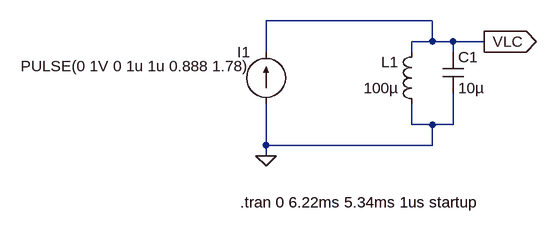
[diagram p0: schematic LC4.asc]
LC4.asc, the LTspice schematic file:
Version 4
SHEET 1 880 680
WIRE 400 208 144 208
WIRE 400 240 400 208
WIRE 400 240 368 240
WIRE 432 240 400 240
WIRE 480 240 432 240
WIRE 144 256 144 208
WIRE 368 256 368 240
WIRE 432 256 432 240
WIRE 368 368 368 336
WIRE 400 368 368 368
WIRE 432 368 432 320
WIRE 432 368 400 368
WIRE 144 400 144 336
WIRE 400 400 400 368
WIRE 400 400 144 400
WIRE 144 416 144 400
FLAG 144 416 0
FLAG 480 240 VLC
IOPIN 480 240 Out
SYMBOL current 144 336 R180
WINDOW 0 24 80 Left 2
WINDOW 3 24 58 Left 2
SYMATTR InstName I1
SYMATTR Value PULSE(0 1V 0 1u 1u 0.888 1.78)
SYMBOL ind 384 352 R180
WINDOW 0 36 80 Left 2
WINDOW 3 36 40 Left 2
SYMATTR InstName L1
SYMATTR Value 100µ
SYMATTR SpiceLine Ipk=1 Rser=85m Rpar=infin. Cpar=0 mfg="Coiltronics" pn="CTX100-1-52"
SYMBOL cap 416 256 R0
SYMATTR InstName C1
SYMATTR Value 10µ
TEXT 104 488 Left 2 !.tran 0 6.22ms 5.34ms 1us startup

The netlist it stands for:
* LC4.asc
I1 0 VLC PULSE(0 1V 0 1u 1u 0.888 1.78)
L1 0 VLC 100µ Ipk=1 Rser=85m Rpar=infin. Cpar=0 mfg="Coiltronics" pn="CTX100-1-52"
C1 VLC 0 10µ
.tran 0 6.22ms 5.34ms 1us startup
.backanno
.end